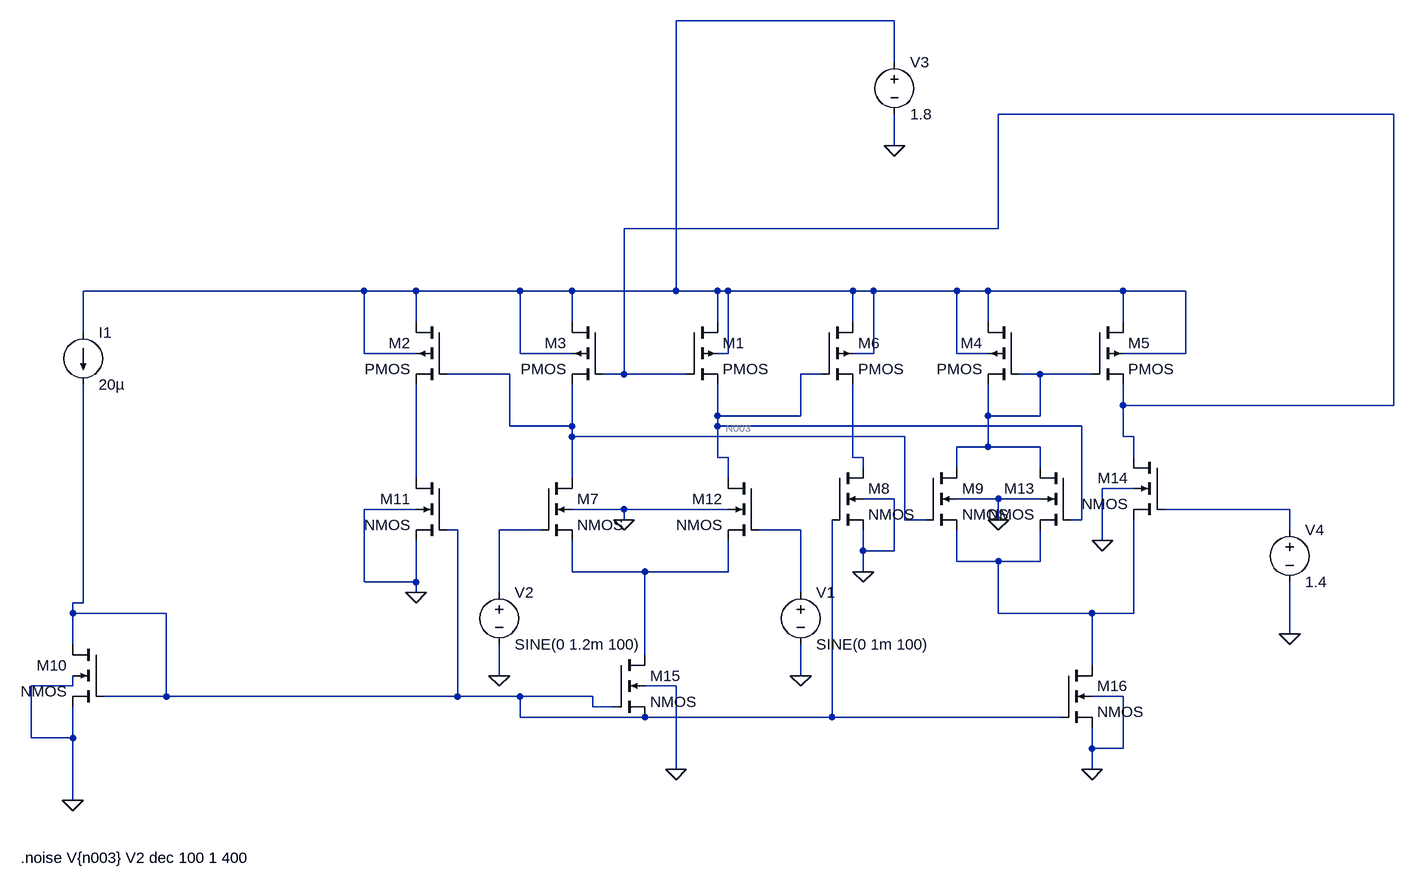
[diagram p0: schematic cmfb_single.asc]
cmfb_single.asc, the LTspice schematic file:
Version 4
SHEET 1 1284 760
WIRE 512 -544 176 -544
WIRE 512 -480 512 -544
WIRE 1280 -400 672 -400
WIRE 512 -352 512 -400
WIRE 672 -224 672 -400
WIRE 672 -224 96 -224
WIRE -448 -128 -736 -128
WIRE -304 -128 -448 -128
WIRE -224 -128 -304 -128
WIRE -64 -128 -224 -128
WIRE 16 -128 -64 -128
WIRE 176 -128 176 -544
WIRE 176 -128 16 -128
WIRE 240 -128 176 -128
WIRE 256 -128 240 -128
WIRE 448 -128 256 -128
WIRE 480 -128 448 -128
WIRE 608 -128 480 -128
WIRE 656 -128 608 -128
WIRE 864 -128 656 -128
WIRE 960 -128 864 -128
WIRE -224 -80 -224 -128
WIRE 16 -80 16 -128
WIRE 240 -80 240 -128
WIRE 448 -80 448 -128
WIRE 656 -80 656 -128
WIRE 864 -80 864 -128
WIRE -736 -64 -736 -128
WIRE -304 -32 -304 -128
WIRE -224 -32 -304 -32
WIRE -64 -32 -64 -128
WIRE 16 -32 -64 -32
WIRE 256 -32 256 -128
WIRE 256 -32 240 -32
WIRE 480 -32 480 -128
WIRE 480 -32 448 -32
WIRE 608 -32 608 -128
WIRE 656 -32 608 -32
WIRE 960 -32 960 -128
WIRE 960 -32 864 -32
WIRE -80 0 -176 0
WIRE 96 0 96 -224
WIRE 96 0 64 0
WIRE 128 0 96 0
WIRE 192 0 128 0
WIRE 400 0 368 0
WIRE 736 0 704 0
WIRE 816 0 736 0
WIRE 448 32 448 16
WIRE 16 48 16 16
WIRE 240 48 240 16
WIRE 864 48 864 16
WIRE 1280 48 1280 -400
WIRE 1280 48 864 48
WIRE 240 64 240 48
WIRE 368 64 368 0
WIRE 368 64 240 64
WIRE 656 64 656 16
WIRE 736 64 736 0
WIRE 736 64 656 64
WIRE -224 80 -224 16
WIRE -80 80 -80 0
WIRE 16 80 16 48
WIRE 16 80 -80 80
WIRE 240 80 240 64
WIRE 800 80 240 80
WIRE 16 96 16 80
WIRE 528 96 16 96
WIRE 864 96 864 48
WIRE 880 96 864 96
WIRE 624 112 608 112
WIRE 656 112 656 64
WIRE 656 112 624 112
WIRE 736 112 656 112
WIRE 240 128 240 80
WIRE 256 128 240 128
WIRE 448 128 448 32
WIRE 464 128 448 128
WIRE 880 128 880 96
WIRE 464 144 464 128
WIRE 608 144 608 112
WIRE 736 144 736 112
WIRE -224 160 -224 80
WIRE 16 160 16 96
WIRE 256 160 256 128
WIRE 880 176 832 176
WIRE 512 192 464 192
WIRE 672 192 608 192
WIRE 736 192 672 192
WIRE -224 208 -304 208
WIRE 96 208 16 208
WIRE 256 208 96 208
WIRE 1120 208 928 208
WIRE 96 224 96 208
WIRE 528 224 528 96
WIRE 560 224 528 224
WIRE 672 224 672 192
WIRE 800 224 800 80
WIRE 800 224 784 224
WIRE -160 240 -176 240
WIRE -32 240 -96 240
WIRE 368 240 304 240
WIRE 1120 240 1120 208
WIRE 832 256 832 176
WIRE -160 272 -160 240
WIRE 464 272 464 240
WIRE 512 272 512 192
WIRE 512 272 464 272
WIRE 608 288 608 240
WIRE 672 288 608 288
WIRE 736 288 736 240
WIRE 736 288 672 288
WIRE 16 304 16 256
WIRE 32 304 16 304
WIRE 128 304 32 304
WIRE 208 304 128 304
WIRE 256 304 256 256
WIRE 256 304 208 304
WIRE 464 304 464 272
WIRE 880 304 880 224
WIRE -304 320 -304 208
WIRE -224 320 -224 256
WIRE -224 320 -304 320
WIRE -224 336 -224 320
WIRE -96 336 -96 240
WIRE 368 336 368 240
WIRE -736 352 -736 16
WIRE -736 352 -752 352
WIRE -752 368 -752 352
WIRE -608 368 -752 368
WIRE 672 368 672 288
WIRE 816 368 672 368
WIRE 880 368 880 304
WIRE 880 368 816 368
WIRE 416 384 416 224
WIRE 1120 400 1120 320
WIRE -752 416 -752 368
WIRE 128 432 128 304
WIRE 816 448 816 368
WIRE -96 464 -96 416
WIRE 368 464 368 416
WIRE -752 480 -752 464
WIRE -752 480 -816 480
WIRE 176 480 128 480
WIRE -608 496 -608 368
WIRE -608 496 -704 496
WIRE -272 496 -608 496
WIRE -160 496 -160 272
WIRE -160 496 -272 496
WIRE -64 496 -160 496
WIRE 48 496 -64 496
WIRE 864 496 816 496
WIRE 48 512 48 496
WIRE 80 512 48 512
WIRE -64 528 -64 496
WIRE 128 528 -64 528
WIRE 416 528 416 384
WIRE 416 528 128 528
WIRE 768 528 416 528
WIRE -816 560 -816 480
WIRE -752 560 -752 512
WIRE -752 560 -816 560
WIRE 816 576 816 544
WIRE 864 576 864 496
WIRE 864 576 816 576
WIRE 176 608 176 480
WIRE 816 608 816 576
WIRE -752 656 -752 560
FLAG 816 608 0
FLAG -96 464 0
FLAG 368 464 0
FLAG -224 336 0
FLAG 464 304 0
FLAG 512 -352 0
FLAG -752 656 0
FLAG 672 224 0
FLAG 96 224 0
FLAG 832 256 0
FLAG 176 608 0
FLAG 1120 400 0
DATAFLAG -448 -128 ""
DATAFLAG 128 0 ""
DATAFLAG 32 304 ""
DATAFLAG 208 304 ""
DATAFLAG -160 272 ""
DATAFLAG 416 384 ""
DATAFLAG -272 496 ""
DATAFLAG 240 48 ""
DATAFLAG -224 80 ""
DATAFLAG 16 48 ""
DATAFLAG 448 32 ""
DATAFLAG 624 112 ""
DATAFLAG 880 96 ""
DATAFLAG 880 304 ""
SYMBOL voltage 368 320 R0
WINDOW 123 0 0 Left 2
WINDOW 39 0 0 Left 2
SYMATTR InstName V1
SYMATTR Value SINE(0 1m 100)
SYMBOL voltage -96 320 R0
WINDOW 123 0 0 Left 2
WINDOW 39 0 0 Left 2
SYMATTR InstName V2
SYMATTR Value SINE(0 1.2m 100)
SYMBOL voltage 512 -496 R0
WINDOW 123 0 0 Left 2
WINDOW 39 0 0 Left 2
SYMATTR InstName V3
SYMATTR Value 1.8
SYMBOL current -736 -64 R0
WINDOW 123 0 0 Left 2
WINDOW 39 0 0 Left 2
SYMATTR InstName I1
SYMATTR Value 20µ
SYMBOL nmos4 -32 160 R0
SYMATTR InstName M7
SYMATTR Value2 l=1u w=20u
SYMBOL nmos4 416 144 R0
SYMATTR InstName M8
SYMATTR Value2 l=2u w=20u
SYMBOL nmos4 560 144 R0
SYMATTR InstName M9
SYMATTR Value2 l=1u w=10u
SYMBOL nmos4 -704 416 M0
SYMATTR InstName M10
SYMATTR Value2 l=2u w=20u
SYMBOL nmos4 -176 160 M0
SYMATTR InstName M11
SYMATTR Value2 l=2u w=20u
SYMBOL nmos4 304 160 M0
SYMATTR InstName M12
SYMATTR Value2 l=1u w=20u
SYMBOL nmos4 784 144 M0
SYMATTR InstName M13
SYMATTR Value2 l=1u w=10u
SYMBOL nmos4 928 128 M0
SYMATTR InstName M14
SYMATTR Value2 l=1u w=10u
SYMBOL nmos4 80 432 R0
SYMATTR InstName M15
SYMATTR Value2 l=2u w=20u
SYMBOL nmos4 768 448 R0
SYMATTR InstName M16
SYMATTR Value2 l=2u w=20u
SYMBOL pmos4 192 -80 R0
SYMATTR InstName M1
SYMATTR Value2 l=5u w=10u
SYMBOL pmos4 -176 -80 M0
SYMATTR InstName M2
SYMATTR Value2 l=5u w=10u
SYMBOL pmos4 64 -80 M0
SYMATTR InstName M3
SYMATTR Value2 l=5u w=10u
SYMBOL pmos4 704 -80 M0
SYMATTR InstName M4
SYMATTR Value2 l=5u w=10u
SYMBOL pmos4 816 -80 R0
SYMATTR InstName M5
SYMATTR Value2 l=5u w=10u
SYMBOL pmos4 400 -80 R0
SYMATTR InstName M6
SYMATTR Value2 l=5u w=10u
SYMBOL voltage 1120 224 R0
WINDOW 123 0 0 Left 2
WINDOW 39 0 0 Left 2
SYMATTR InstName V4
SYMATTR Value 1.4
TEXT -832 744 Left 2 !.noise V{n003} V2 dec 100 1 400

The netlist it stands for:
* cmfb_single.asc
V1 N011 0 SINE(0 1m 100)
V2 N010 0 SINE(0 1.2m 100)
V3 N001 0 1.8
I1 N001 N009 20µ
M7 N003 N010 N013 0 NMOS l=1u w=20u
M8 N006 N009 0 0 NMOS l=2u w=20u
M9 N005 N003 N012 0 NMOS l=1u w=10u
M10 N009 N009 0 0 NMOS l=2u w=20u
M11 N007 N009 0 0 NMOS l=2u w=20u
M12 N004 N011 N013 0 NMOS l=1u w=20u
M13 N005 N004 N012 0 NMOS l=1u w=10u
M14 N002 N008 N012 0 NMOS l=1u w=10u
M15 N013 N009 N009 0 NMOS l=2u w=20u
M16 N012 N009 0 0 NMOS l=2u w=20u
M1 N001 N002 N004 N001 PMOS l=5u w=10u
M2 N001 N003 N007 N001 PMOS l=5u w=10u
M3 N001 N002 N003 N001 PMOS l=5u w=10u
M4 N001 N005 N005 N001 PMOS l=5u w=10u
M5 N001 N005 N002 N001 PMOS l=5u w=10u
M6 N001 N004 N006 N001 PMOS l=5u w=10u
V4 N008 0 1.4
.model NMOS NMOS
.model PMOS PMOS
.lib standard.mos
.noise V{n003} V2 dec 100 1 400
.backanno
.end